# Altium schematic sheet Rough schematic by Arnar.SchDoc
size A4; SheetNumber: 1; SheetTotal: 1; SPICEModelCacheTYMRYVMO: <root> / <DocumentId>TYMRYVMO</DocumentId> / <CacheFrame Number="0"> / <Model Name="led1" Kind="MDL"> / <Text>*Typ RED GaAs LED: Vf=1.7V Vr=4V If=40mA trr=3uS / *LED Pinout: 1=A, 2=K / .MODEL LED1 D (IS=93.2P RS=42M N=3.73 BV=4 IBV=10U / + CJO=2.97P VJ=.75 M=.333 TT=4.32U)</Text> / </Model> / </CacheFrame> / </root>
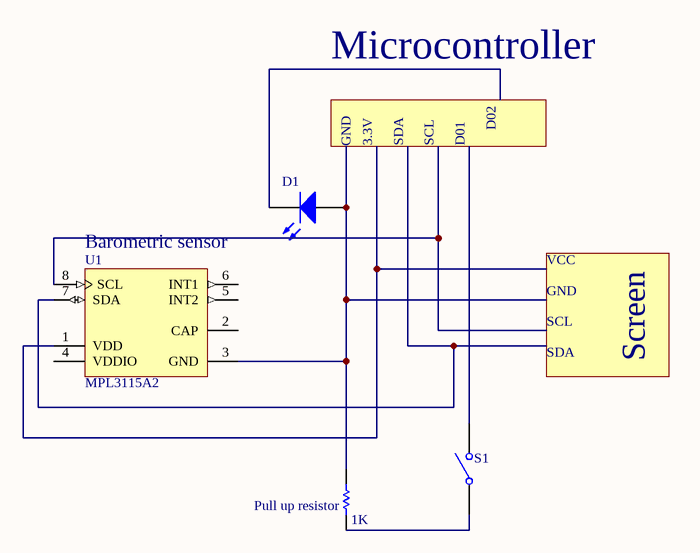
[diagram p0: Rough schematic by Arnar.SchDoc]

## Parts
D1  LED1  [LED-1]  (value not drawn)
R?  value 1K  [AXIAL-0.3]  (hidden comment: Res1)
S1  SW-SPST  [SPST-2]  (value not drawn)
U1  MPL3115A2  [FRES-2153-01_V]

## Nets
NetD1_1: D1.1(A) R?.2 U1.3(GND)
NetR?_1: R?.1 S1.1(COMMON)

Not connected (* = marked no-connect by the designer): D1 2(K); S1 2(NO); U1 1(VDD) 2(CAP) 4(VDDIO) 5(INT2) 6(INT1) 7(SDA) 8(SCL)

## Notes on the sheet
- Microcontroller
- GND
- 3.3V
- SDA
- SCL
- D01
- D02
- (near U1) Barometric sensor
- VCC
- Screen
- (near R?) Pull up resistor

## Library data of the parts
D1 = LED1: Typical RED GaAs LED; Published: 8-Jun-2000; LatestRevisionDate: 08-Jul-2005; LatestRevisionNote: Mech Layer 1 removed.; PackageReference: LED-1; Publisher: Altium Limited; PackageDescription: LED; 2 Leads
R? = Res1: Resistor; Published: 8-Jun-2000; LatestRevisionDate: 17-Jul-2002; LatestRevisionNote: Re-released for DXP Platform.; PackageReference: AXIAL-0.3; Publisher: Altium Limited; PackageDescription: Axial Device, Thru-Hole; 2 Leads; 0.3 in Pin Spacing
S1 = SW-SPST: Single-Pole, Single-Throw Switch; Published: 24-Mar-1999; LatestRevisionDate: 17-Jul-2002; LatestRevisionNote: Re-released for DXP Platform.; PackageReference: SPST-2; Publisher: Altium Limited; PackageDescription: Switch; 2 Leads
U1 = CMP-010-00013-3: I2C Precision Pressure Sensor with Altimetry, 1.95 to 3.6 V, -40 to 85 degC, 8-Pin LGA, RoHS, Tray; Manufacturer: Freescale Semiconductor; Max Supply Voltage: 3.6V; Nominal Supply Current: 2µA; Nominal Supply Voltage: 2.5V; Output Voltage: 3.9V; Min Supply Voltage: 1.95V; Datasheet Version: Rev. 4.0, 09/2015; Pins: 8; Package Reference: 2153-01; Max Operating Temperature: 85°C; Case/Package: LGA; Min Operating Temperature: -40°C; RoHS Compliant: True; Sensor Type: Pressure; Package Quantity: 490; Datasheet URL: http://cache.freescale.com/files/sensors/doc/data_sheet/MPL3115A2.pdf; Packaging: Tray